# EAGLE design dfx-mem (EAGLE 5.11)
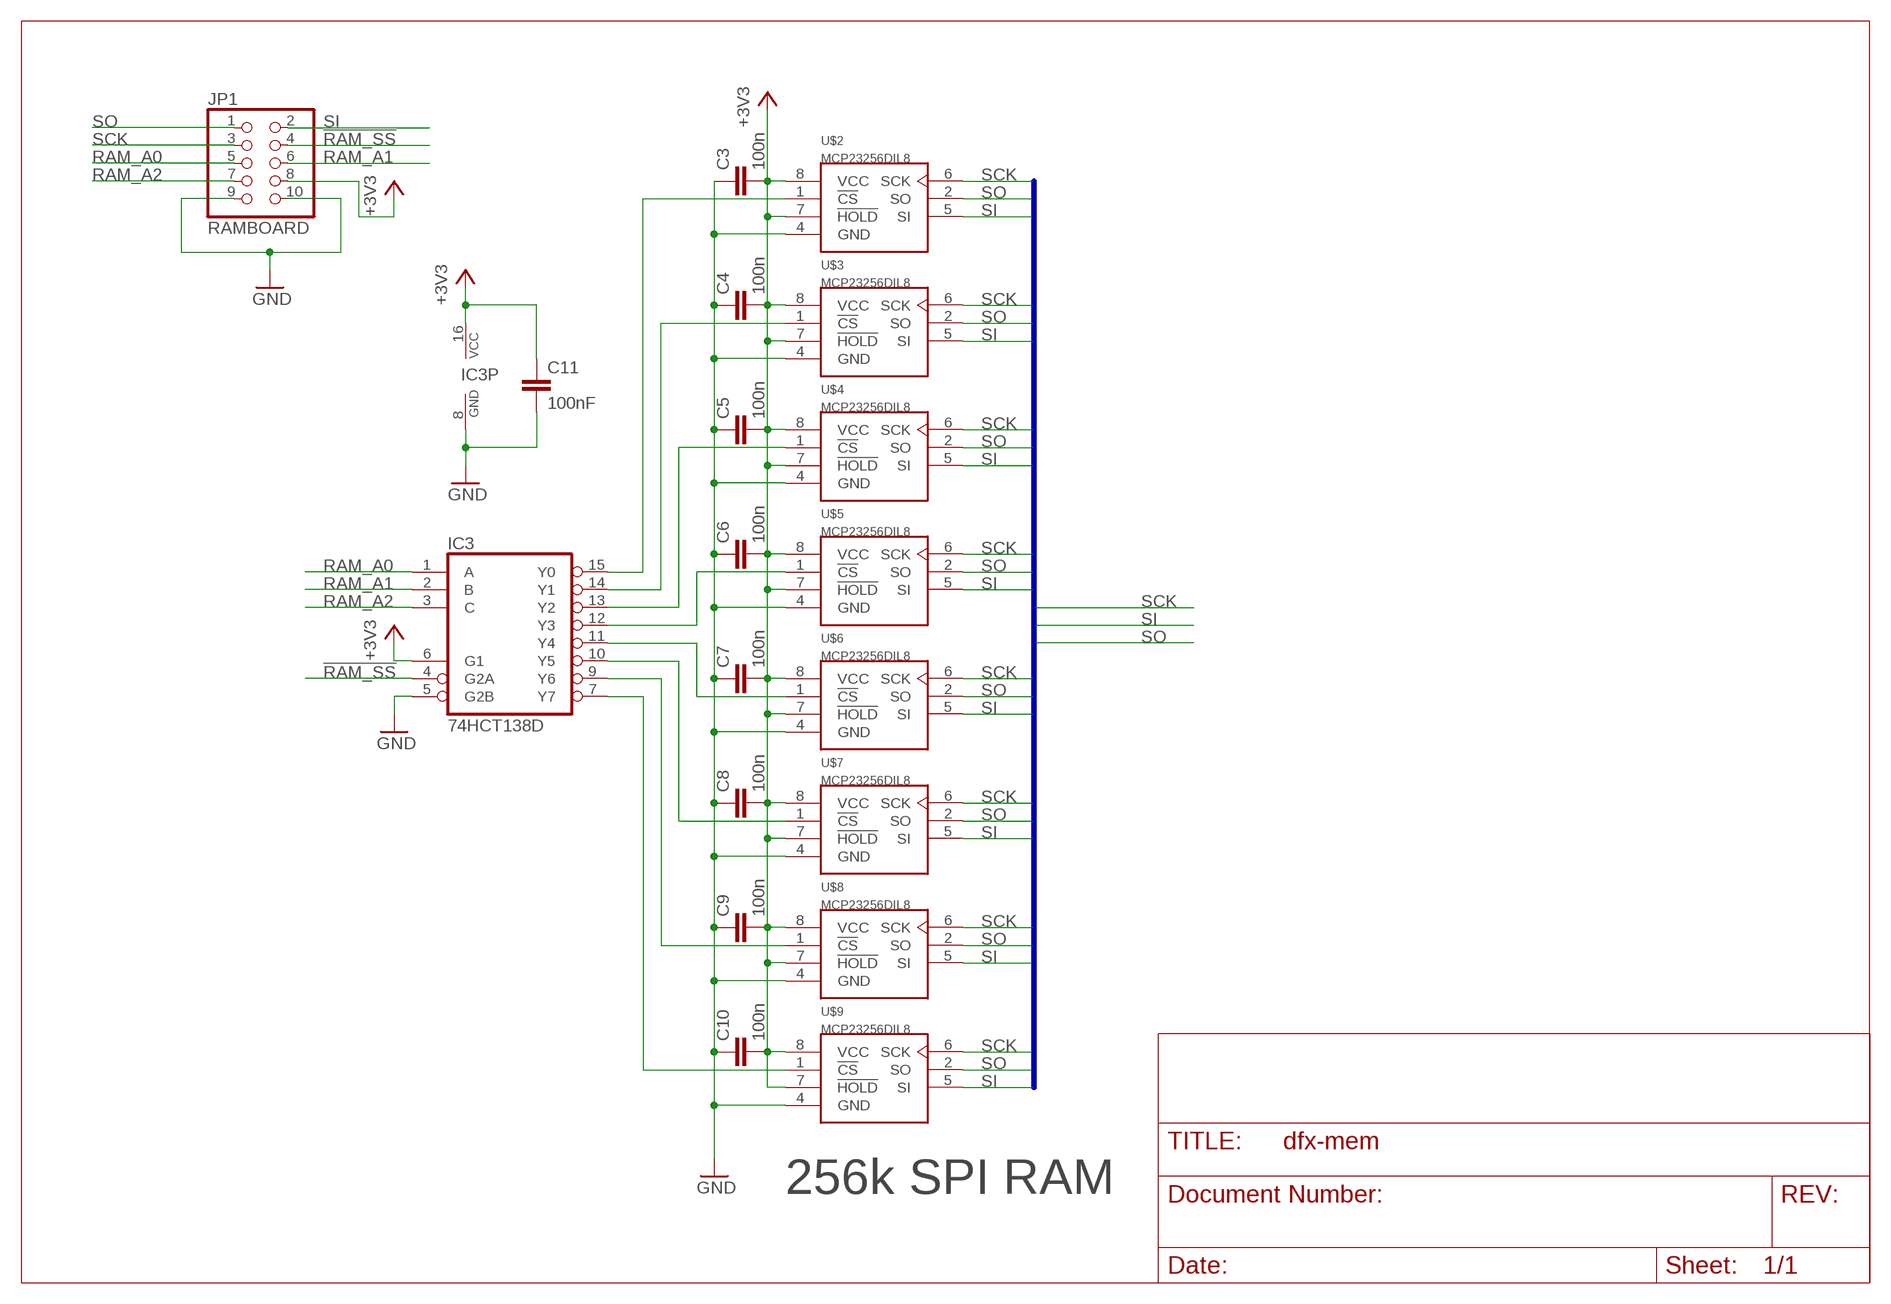
[diagram p0: schematic, sheet 1]

## Parts
C3  100n  C-EUC0805  [C0805]
C4  100n  C-EUC0805  [C0805]
C5  100n  C-EUC0805  [C0805]
C6  100n  C-EUC0805  [C0805]
C7  100n  C-EUC0805  [C0805]
C8  100n  C-EUC0805  [C0805]
C9  100n  C-EUC0805  [C0805]
C10  100n  C-EUC0805  [C0805]
C11  100nF  C-EUC0805  [C0805]
IC3  74HCT138D  [SO16]
JP1  RAMBOARD  PINHD-2X5  [2X05]
U$2  MCP23256DIL8  MCP23256SN  [SO-08]
U$3  MCP23256DIL8  MCP23256SN  [SO-08]
U$4  MCP23256DIL8  MCP23256SN  [SO-08]
U$5  MCP23256DIL8  MCP23256SN  [SO-08]
U$6  MCP23256DIL8  MCP23256SN  [SO-08]
U$7  MCP23256DIL8  MCP23256SN  [SO-08]
U$8  MCP23256DIL8  MCP23256SN  [SO-08]
U$9  MCP23256DIL8  MCP23256SN  [SO-08]

## Nets
!RAM_SS: IC3.4(G2A) JP1.4
+3V3 [POWER]: C3.2 C4.2 C5.2 C6.2 C7.2 C8.2 C9.2 C10.2 C11.1 IC3.6(G1) IC3.16(VCC) JP1.8 U$2.7(!HOLD) U$2.8(VCC) U$3.7(!HOLD) U$3.8(VCC) U$4.7(!HOLD) U$4.8(VCC) U$5.7(!HOLD) U$5.8(VCC) U$6.7(!HOLD) U$6.8(VCC) U$7.7(!HOLD) U$7.8(VCC) U$8.7(!HOLD) U$8.8(VCC) U$9.7(!HOLD) U$9.8(VCC)
GND [POWER]: C3.1 C4.1 C5.1 C6.1 C7.1 C8.1 C9.1 C10.1 C11.2 IC3.5(G2B) IC3.8(GND) JP1.9 JP1.10 U$2.4(GND) U$3.4(GND) U$4.4(GND) U$5.4(GND) U$6.4(GND) U$7.4(GND) U$8.4(GND) U$9.4(GND)
N$5: IC3.15(Y0) U$2.1(!CS)
N$6: IC3.14(Y1) U$3.1(!CS)
N$7: IC3.13(Y2) U$4.1(!CS)
N$16: IC3.12(Y3) U$5.1(!CS)
N$17: IC3.11(Y4) U$6.1(!CS)
N$18: IC3.10(Y5) U$7.1(!CS)
N$19: IC3.9(Y6) U$8.1(!CS)
N$20: IC3.7(Y7) U$9.1(!CS)
RAM_A0: IC3.1(A) JP1.5
RAM_A1: IC3.2(B) JP1.6
RAM_A2: IC3.3(C) JP1.7
SCK: JP1.3 U$2.6(SCK) U$3.6(SCK) U$4.6(SCK) U$5.6(SCK) U$6.6(SCK) U$7.6(SCK) U$8.6(SCK) U$9.6(SCK)
SI: JP1.2 U$2.5(SI) U$3.5(SI) U$4.5(SI) U$5.5(SI) U$6.5(SI) U$7.5(SI) U$8.5(SI) U$9.5(SI)
SO: JP1.1 U$2.2(SO) U$3.2(SO) U$4.2(SO) U$5.2(SO) U$6.2(SO) U$7.2(SO) U$8.2(SO) U$9.2(SO)

## Buses
SPI:SCK,SI,SO

## Notes on the sheet
- 256k SPI RAM

## Library data of the parts
C3-C11 = rcl:C-EU: CAPACITOR, European symbol
IC3 = 74xx-eu:74*138: 3-line to 8-line DECODER/DEMULTIPLEXER
JP1 = pinhead:PINHD-2X5: PIN HEADER
U$2-U$9 = cvlib:MCP23*256

## Board
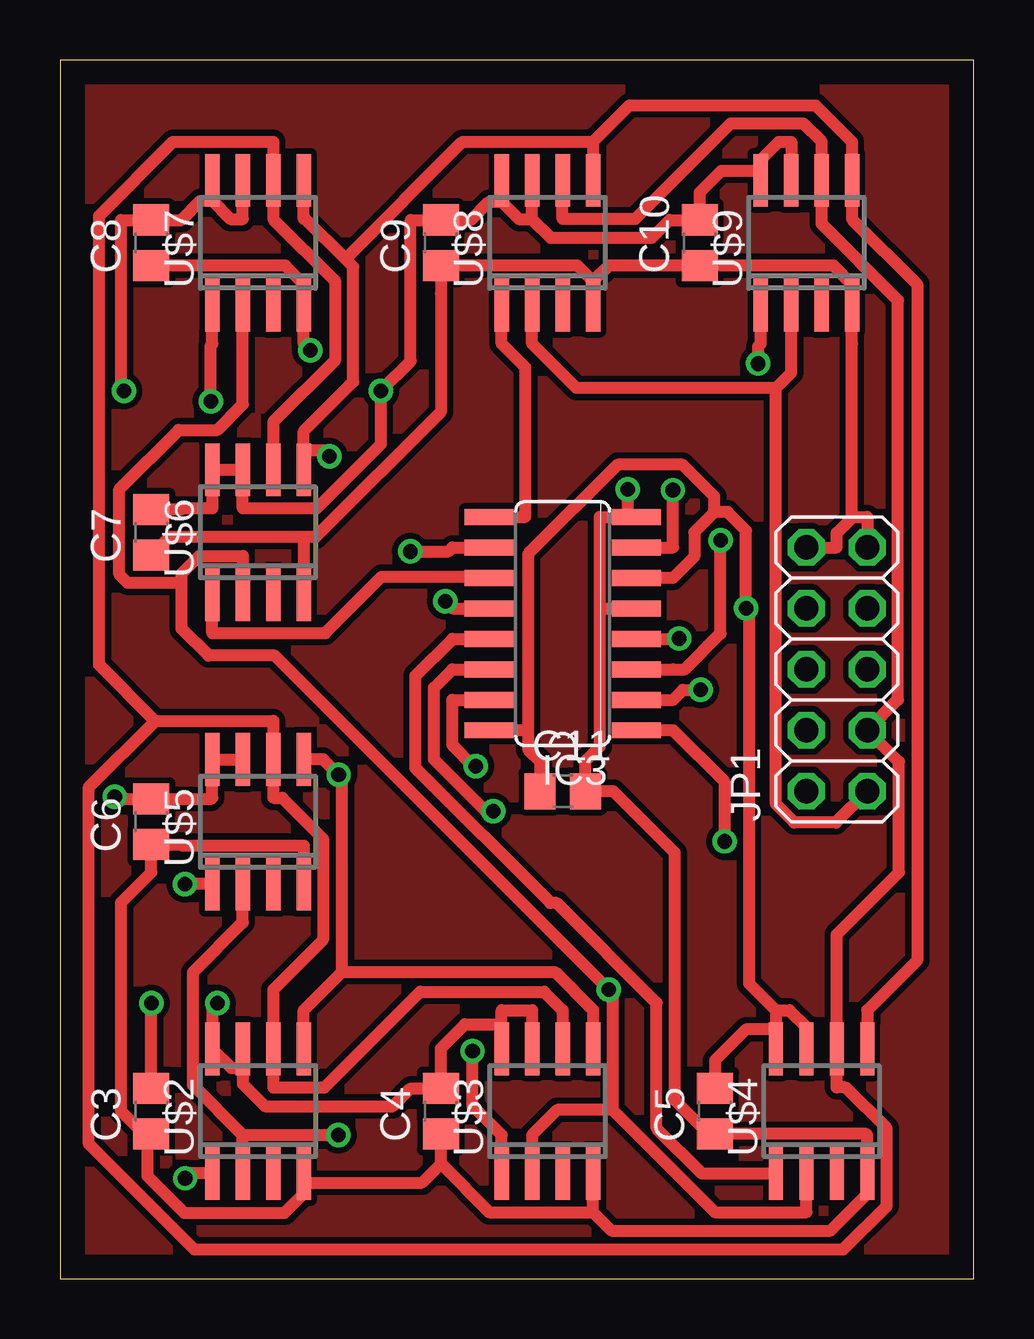
[diagram p1: board, top side]
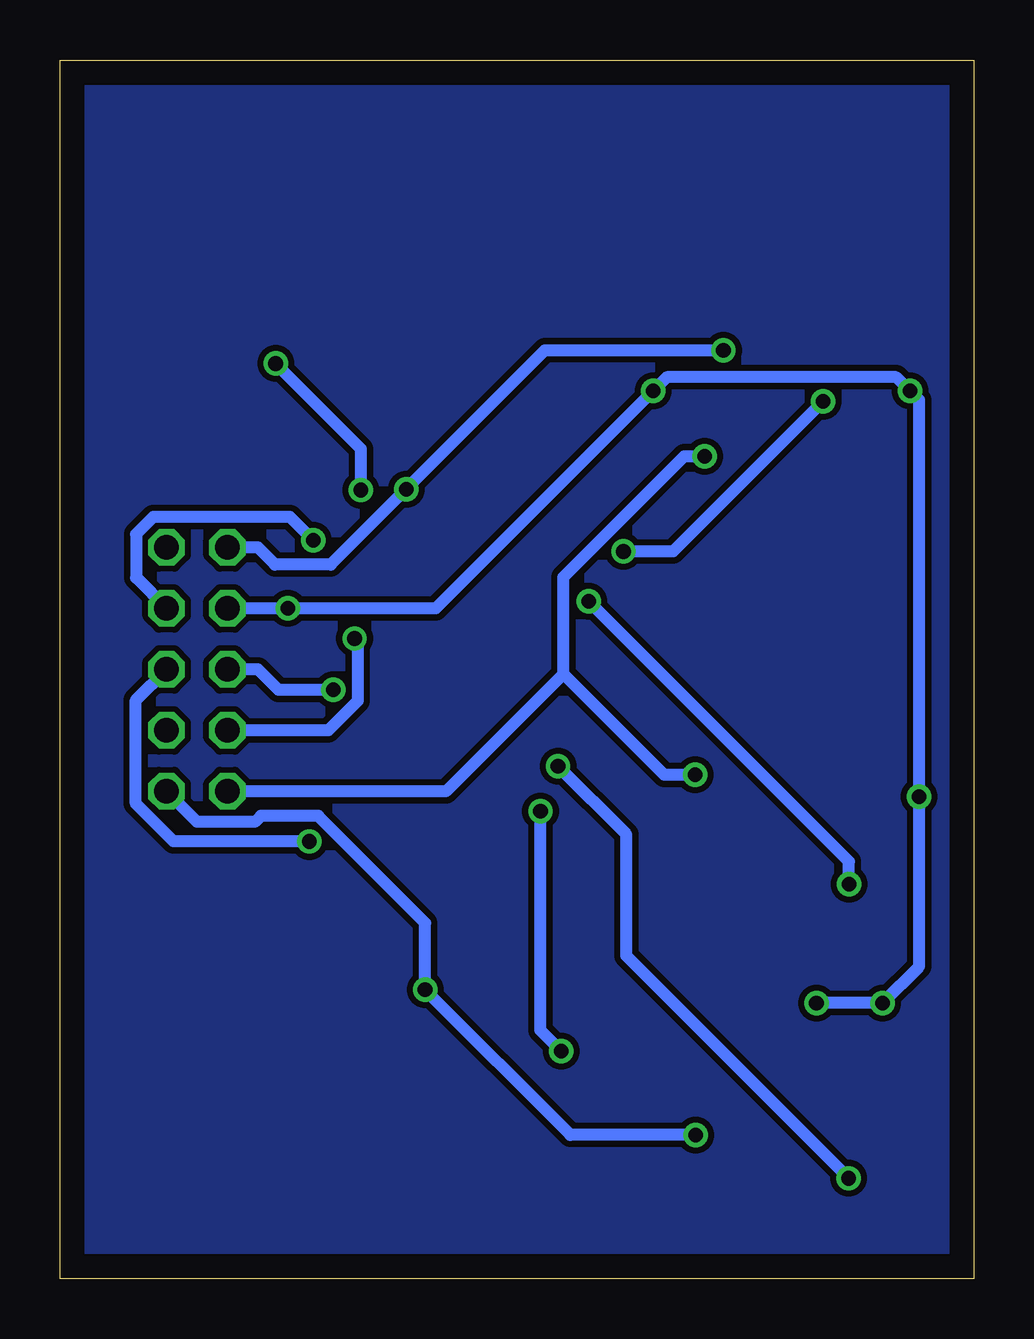
[diagram p2: board, bottom side, seen from below]

Size 38.1 x 50.8 mm. Coordinates in mm from the lower left corner, seen from the top.
Outline: 0,0 38.1,0 38.1,50.8 0,50.8 0,0
Copper layers (1*16): Top 0.035mm / dielectric 1.5mm / Bottom 0.035mm
Design rules "default *": minimum track width 20mil, minimum drill 24mil, track to track 10mil, track to pad 10mil, pad to pad 10mil, via to via 10mil, smd to smd 10mil, copper to edge 40mil, drill to drill 8mil, minimum pad ring 10mil, minimum via ring 8mil, stop-mask expansion 4mil, vias tented up to drill 0mil, thermal gap 10mil
vRestrict: area 5.7,5.1 to 10.8,8.9; area 17.8,5.1 to 22.9,8.9; area 29.2,5.1 to 34.3,8.9; area 5.7,17.1 to 10.8,21; area 19,22.2 to 22.9,32.4; area 5.7,29.2 to 10.8,33; area 5.7,41.3 to 10.8,45.1; area 17.8,41.3 to 22.9,45.1; area 28.6,41.3 to 33.7,45.1

### Footprints (pad centres in the part's own frame; a part is rotated, then mirrored left to right if it is on the bottom)
C0805 = smd 1.3 x 1.5: 1 -0.95,0; 2 0.95,0
SO16 = smd 0.66 x 2.032: 1 -4.445,-3.073; 2 -3.175,-3.073; 3 -1.905,-3.073; 4 -0.635,-3.073; 5 0.635,-3.073; 6 1.905,-3.073; 7 3.175,-3.073; 8 4.445,-3.073; 9 4.445,3.073; 10 3.175,3.073; 11 1.905,3.073; 12 0.635,3.073; 13 -0.635,3.073; 14 -1.905,3.073; 15 -3.175,3.073; 16 -4.445,3.073
2X05 = drill 1.016 octagon: 1 -5.08,-1.27; 2 -5.08,1.27; 3 -2.54,-1.27; 4 -2.54,1.27; 5 0,-1.27; 6 0,1.27; 7 2.54,-1.27; 8 2.54,1.27; 9 5.08,-1.27; 10 5.08,1.27
SO-08 = smd 0.6 x 2.2: 1 -1.905,-2.6; 2 -0.635,-2.6; 3 0.635,-2.6; 4 1.905,-2.6; 5 1.905,2.6; 6 0.635,2.6; 7 -0.635,2.6; 8 -1.905,2.6

### Placement (x,y rotation side)
C3  3.81,6.99 90 top
C4  15.88,6.99 90 top
C5  27.3,6.99 90 top
C6  3.81,19.05 90 top
C7  3.81,31.11 90 top
C8  3.81,43.18 90 top
C9  15.88,43.18 90 top
C10  26.67,43.18 90 top
C11  20.95,20.32 0 top
IC3  20.95,27.3 90 top
JP1  32.38,25.4 90 top
U$2  8.26,6.99 0 top
U$3  20.32,6.99 0 top
U$4  31.75,6.99 0 top
U$5  8.26,19.05 0 top
U$6  8.26,31.11 0 top
U$7  8.26,43.18 0 top
U$8  20.32,43.18 0 top
U$9  31.11,43.18 0 top

### Tracks (layer width: path | path; a pad name or v marks a point on that pad's centre or on a via)
!RAM_SS  (via drill 0.61 pad 1.02)
  Top 0.508: v25.82,26.69 25.57,26.69 25.55,26.67 IC3.4
  Bottom 0.508: JP1.4 26.91,22.86 25.69,24.09 25.69,26.56 v25.82,26.69
+3V3  (via drill 0.61 pad 1.02)
  Top 0.508: C7.2 5.07,32.06 5.11,32.11 6.35,32.11 U$6.8 U$6.7 7.62,32.11 10.7,32.11 13.37,34.78 v13.37,37.01 14.62,38.26 14.62,44.13 C9.2 17.13,44.13 17.89,44.89 18.41,44.89 | 29.84,11.19 28.73,12.31 28.73,27.81 v28.6,27.94 28.6,31.18 27.82,31.96 27.28,31.96 | v2.28,20.1 2.38,20 C6.2 5.07,20 6.31,20 6.35,20.04 U$5.8 U$5.7 | 7.62,8.78 7.62,8.12 8.55,7.19 13.88,7.19 14.62,7.93 C4.2 15.88,9.6 16.88,10.61 18.41,10.61 | 7.62,8.78 7.15,8.78 U$2.8 6.35,11.19 6.57,11.41 v6.57,11.49 | 27.28,31.96 26.44,31.12 26.44,30.1 25.55,29.21 IC3.6 | 27.28,31.96 27.28,32.61 25.95,33.93 23.25,33.93 19.52,30.2 19.52,22.86 | v2.67,37.01 2.55,37.13 2.55,44.13 C8.2 5.07,44.13 5.86,44.93 6.35,44.93 | C5.2 27.3,9.09 28.6,10.39 29.84,10.39 | 29.84,11.19 29.84,10.39 | 29.84,10.39 U$4.8 | 19.52,22.86 19.52,22.06 20,21.58 C11.1 | 19.52,22.86 19.41,22.86 IC3.16 | 18.41,44.89 19.13,44.17 19.68,44.17 | 18.41,44.89 18.41,45.58 U$8.8 | 6.35,44.93 7.1,44.17 7.62,44.17 U$7.7 | 6.35,44.93 6.35,44.98 U$7.8 | C3.2 v3.81,11.49 | 18.41,10.61 18.41,11.19 19.68,11.19 U$3.7 | 18.41,10.61 U$3.8 | 7.62,8.78 U$2.7 | 29.84,11.19 30.41,11.19 31.11,10.49 31.11,10.39 U$4.7 | 29.21,46.18 27.56,46.18 26.67,45.29 C10.2 25.41,44.13 24.67,43.39 20.47,43.39 19.68,44.17 | 29.21,46.18 29.21,46.63 29.96,47.39 30.48,47.39 U$9.7 | 29.21,46.18 U$9.8 | 19.68,44.17 U$8.7
  Bottom 0.508: v6.57,11.49 v3.81,11.49 2.28,13.02 v2.28,20.1 2.28,36.62 v2.67,37.01 3.24,37.58 12.8,37.58 v13.37,37.01 22.44,27.94 v28.6,27.94 29.84,27.94 JP1.8
GND  (via drill 0.61 pad 1.02)
  Top 0.508: 22.23,2.78 23,2 32.12,2 33.66,3.54 U$4.4 33.66,5.99 33.61,6.04 C5.1 27.04,6.04 25.64,7.44 25.64,17.75 23.06,20.32 C11.2 21.91,21.58 22.5,22.18 22.5,27.94 | 22.23,2.78 17.89,2.78 15.88,4.79 | 10.16,4 15.09,4 15.88,4.79 | 3.65,6.04 3.65,4.27 5.19,2.74 9.36,2.74 10.16,3.54 10.16,4 | 10.16,4 U$2.4 | 3.65,6.04 3.5,6.04 2.55,6.98 2.55,15.68 3.81,16.94 C6.1 5.07,18.1 5.11,18.06 10.16,18.06 U$5.4 | 3.65,6.04 C3.1 | 15.88,4.79 15.88,4.88 | 15.88,4.88 | 15.88,4.88 C4.1 | 23.67,31.75 22.5,31.75 22.5,27.94 | 23.67,31.75 IC3.8 | 23.67,31.75 v23.67,32.91 | 22.5,27.94 22.7,27.94 IC3.5 | 10.16,30.91 10.65,30.91 15.88,36.13 15.88,41.07 C9.1 21.57,42.23 22.23,41.58 | 33.05,31.75 33.02,31.78 33.02,38.97 U$9.4 33.02,41.46 32.25,42.23 C10.1 22.88,42.23 22.23,41.58 | 33.05,31.75 33.66,31.75 JP1.9 | 33.05,31.75 32.38,31.08 32.38,30.48 JP1.10 | v10.44,38.7 10.17,38.97 10.16,38.97 U$7.4 10.16,41.46 9.39,42.23 C8.1 | 10.16,30.91 4.55,30.91 C7.1 | 10.16,30.91 10.16,30.12 U$6.4 | 22.23,2.78 U$3.4 | 22.23,41.58 U$8.4
  Bottom 0.508: JP1.10 29.84,30.48 29.13,29.77 26.81,29.77 v23.67,32.91 17.88,38.7 v10.44,38.7
N$1
  pour Top: 0,50.8 38.1,50.8 38.1,0 0,0
N$2
  pour Bottom: 0,50.8 38.1,50.8 38.1,0 0,0
N$5  (via drill 0.61 pad 1.02)
  Top 0.508: v17.34,21.36 17.25,21.36 16.36,22.25 16.36,24.13 IC3.15 | U$2.1 5.42,4.38 v5.22,4.19
  Bottom 0.508: v5.22,4.19 14.49,13.46 14.49,18.51 v17.34,21.36
N$6  (via drill 0.61 pad 1.02)
  Top 0.508: v18.07,19.49 17.74,19.49 15.59,21.65 15.59,24.63 16.36,25.4 IC3.14 | v17.2,9.48 17.2,7.21 18.41,5.99 U$3.1
  Bottom 0.508: v17.2,9.48 18.07,10.35 v18.07,19.49
N$7
  Top 0.508: U$4.1 26.76,4.38 24.87,6.28 24.87,11.5 20.71,15.66 20.44,15.66 14.82,21.28 14.82,25.14 16.36,26.67 IC3.13
N$16  (via drill 0.61 pad 1.02)
  Top 0.508: v16.06,28.24 16.36,27.94 IC3.12 | U$5.1 v5.21,16.45
  Bottom 0.508: v5.21,16.45 5.21,17.39 v16.06,28.24
N$17
  Top 0.508: IC3.11 17.82,29.27 13.41,29.27 11.05,26.91 6.35,26.91 U$6.1
N$18  (via drill 0.61 pad 1.02)
  Top 0.508: U$7.1 6.35,38.97 6.29,38.91 v6.29,36.56 | IC3.10 16.36,30.48 16.19,30.31 v14.61,30.31
  Bottom 0.508: v6.29,36.56 12.54,30.31 v14.61,30.31
N$19
  Top 0.508: IC3.9 19.41,31.75 19.41,37.98 18.41,38.97 U$8.1
N$20  (via drill 0.61 pad 1.02)
  Top 0.508: U$9.1 29.21,38.97 29.11,38.87 v29.11,38.15 | v25.55,32.87 25.55,30.48 IC3.7
  Bottom 0.508: v29.11,38.15 25.55,34.59 v25.55,32.87
RAM_A0  (via drill 0.61 pad 1.02)
  Top 0.508: v27.71,18.23 27.71,20.7 25.55,22.86 IC3.1
  Bottom 0.508: JP1.5 34.94,24.11 34.94,19.8 33.36,18.23 v27.71,18.23
RAM_A1  (via drill 0.61 pad 1.02)
  Top 0.508: v26.7,24.55 25.97,24.55 25.55,24.13 IC3.2
  Bottom 0.508: JP1.6 29.84,25.4 28.99,24.55 v26.7,24.55
RAM_A2  (via drill 0.61 pad 1.02)
  Top 0.508: v27.54,30.78 27.54,26.89 26.05,25.4 25.55,25.4 IC3.3
  Bottom 0.508: JP1.7 34.93,29.22 34.93,31.03 34.21,31.75 28.51,31.75 v27.54,30.78
SCK
  Top 0.508: U$3.6 20.95,11.19 20.19,11.96 15.02,11.96 11.03,7.98 8.89,7.98 U$2.6 8.89,12.05 10.97,14.13 10.97,18.34 9.27,20.04 8.89,20.04 U$5.6 8.89,22.26 8.89,23.26 | 3.97,23.26 1.2,20.49 1.2,5.62 5.6,1.22 32.65,1.22 34.46,3.04 34.46,6.26 32.75,7.98 32.38,7.98 U$4.6 32.38,14.35 34.97,16.94 34.97,21.54 JP1.3 34.94,24.14 34.94,40.78 31.75,43.97 U$9.6 31.75,47.39 30.99,48.15 27.95,48.15 23.97,44.17 20.95,44.17 U$8.6 | 3.97,23.26 8.89,23.26 | 8.89,23.26 | 3.97,23.26 1.62,25.6 1.62,44.3 4.72,47.39 8.89,47.39 U$7.6 8.89,44.17 11.46,41.6 11.46,38.28 8.89,35.71 U$6.6
SI  (via drill 0.61 pad 1.02)
  Top 0.508: 11.76,12.79 20.63,12.79 22.23,11.19 U$3.5 | 11.76,12.79 10.16,11.19 U$2.5 | 11.76,12.79 11.76,20.87 v11.61,21.01 10.97,21.65 U$5.5 | 11.9,42.5 10.23,44.17 10.16,44.17 U$7.5 | 11.9,42.5 12.22,42.18 12.22,37.38 10.16,35.32 10.16,34.52 | 22.23,47.39 16.79,47.39 11.9,42.5 | 22.23,47.39 23.75,48.91 31.5,48.91 33.02,47.39 U$9.5 33.02,44.98 33.02,44.17 35.74,41.45 35.74,13.28 33.66,11.19 U$4.5 | 10.16,34.52 10.99,34.52 v11.23,34.28 | 10.16,34.52 U$6.5 | 22.23,47.39 U$8.5
  Bottom 0.508: 17.11,25.21 22.01,20.32 29.84,20.32 JP1.2 | 17.11,25.21 12.91,21.01 v11.61,21.01 | v11.23,34.28 12.08,34.28 17.11,29.25 17.11,25.21
SO  (via drill 0.61 pad 1.02)
  Top 0.508: 5.07,29.01 5.07,27.09 6.19,25.97 8.96,25.97 v22.88,12.04 23.04,11.88 23.04,7.03 | U$4.2 31.11,2.78 27.29,2.78 23.04,7.03 | 7.62,5.99 v11.6,5.99 | 23.04,7.03 20.73,7.03 19.68,5.99 U$3.2 | U$2.2 7.62,5.99 | U$5.2 7.62,14.84 5.54,12.76 5.54,8.07 7.62,5.99 | 5.07,29.01 5.07,29.39 5.8,30.12 7.62,30.12 U$6.2 | U$7.2 7.62,36.44 6.57,35.38 4.94,35.38 2.47,32.91 2.47,29.36 2.82,29.01 5.07,29.01 | 29.84,37.13 29.84,19.78 30.61,19.02 32.35,19.02 JP1.1 | 29.84,37.13 30.48,37.77 30.48,38.97 U$9.2 | 29.84,37.13 21.53,37.13 19.68,38.97 U$8.2
  Bottom 0.508: v11.6,5.99 16.83,5.99 v22.88,12.04 22.88,14.83 27.34,19.29 29.72,19.29 29.97,19.05 32.38,19.05 JP1.1